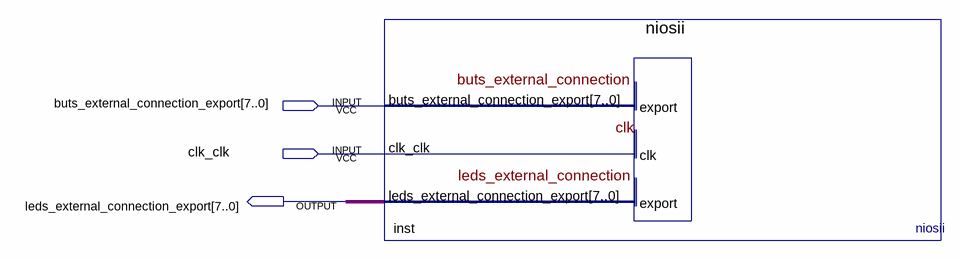
[diagram p0: schematic sheet]
// Quartus schematic NIOS.bdf as structural Verilog: 1 symbols, 3 pins
module NIOS (
  input  [7:0] buts_external_connection_export,
  input  clk_clk,
  output [7:0] leds_external_connection_export
);

  niosii inst (
    .buts_external_connection_export(buts_external_connection_export), .clk_clk(clk_clk),
    .leds_external_connection_export(leds_external_connection_export));
endmodule
